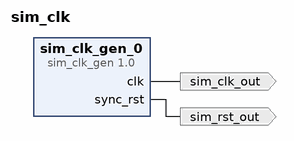
[diagram p0: block diagram of the top level]
# Vivado block design sim_clk, xc7a35ticsg324-1L, Vivado 2018.2
create_bd_design sim_clk

create_bd_port -dir O -type clk sim_clk_out
create_bd_port -dir O -type rst sim_rst_out

create_bd_cell -type ip -vlnv xilinx.com:ip:sim_clk_gen:1.0 sim_clk_gen_0

# ---- connections ----

connect_bd_net [get_bd_pins sim_clk_gen_0/clk] [get_bd_ports sim_clk_out]
connect_bd_net [get_bd_pins sim_clk_gen_0/sync_rst] [get_bd_ports sim_rst_out]

validate_bd_design
save_bd_design
